# Altium schematic sheet demo_dermis_main_testboard_ibias.SchDoc
size E
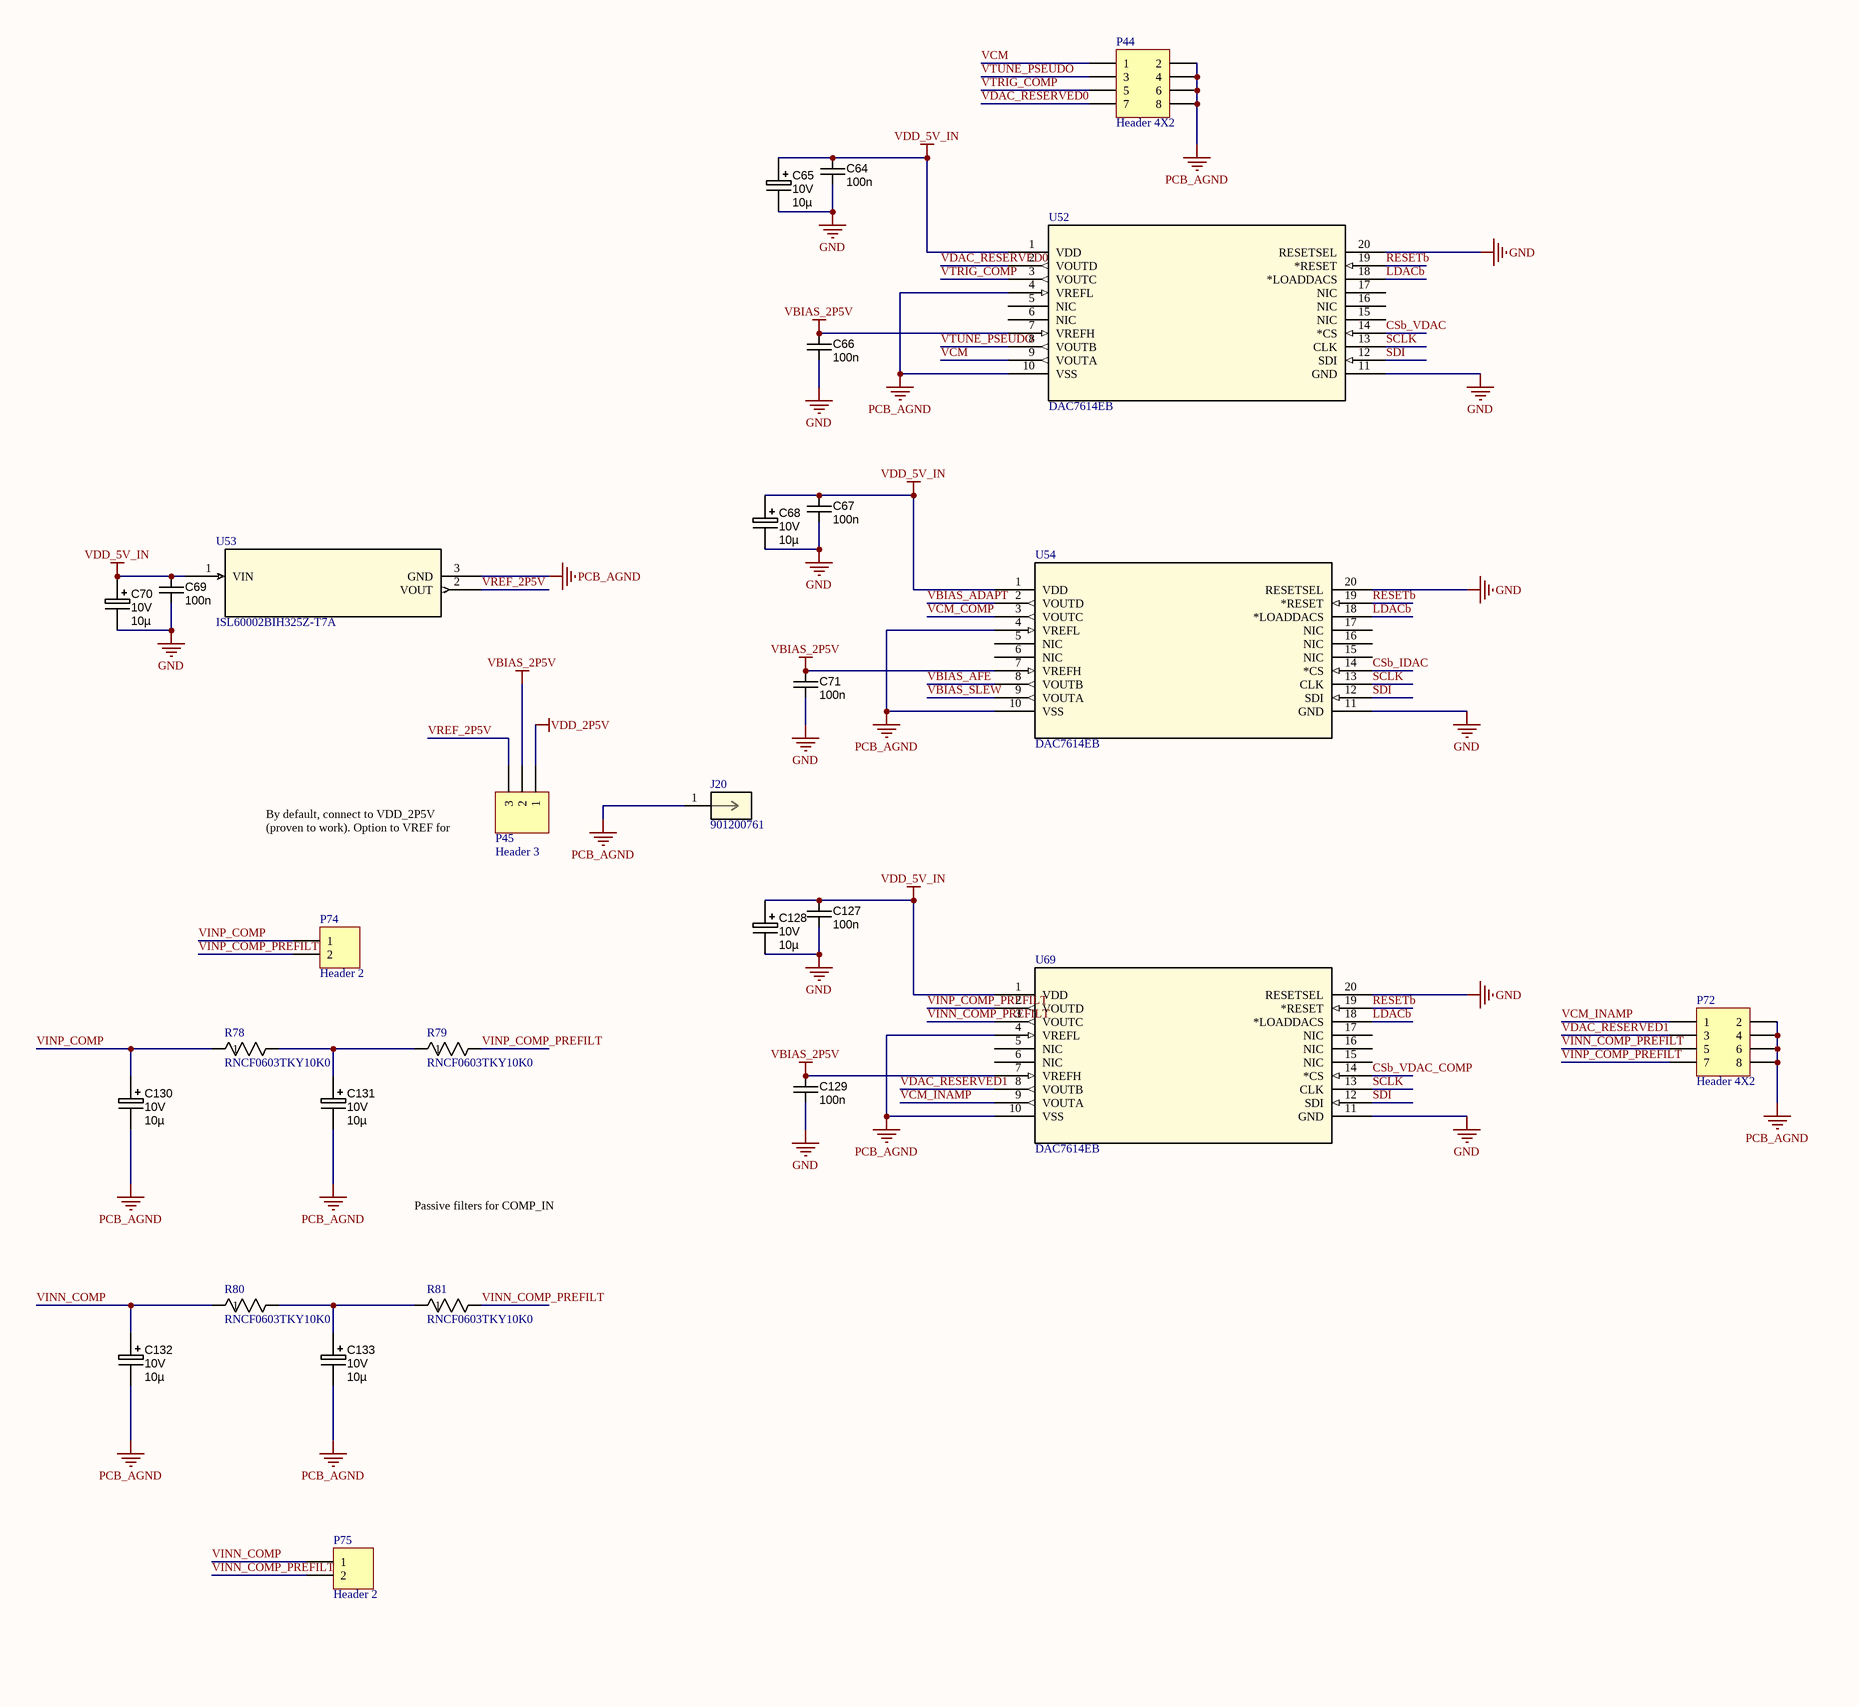
[diagram p0: demo_dermis_main_testboard_ibias.SchDoc, top]
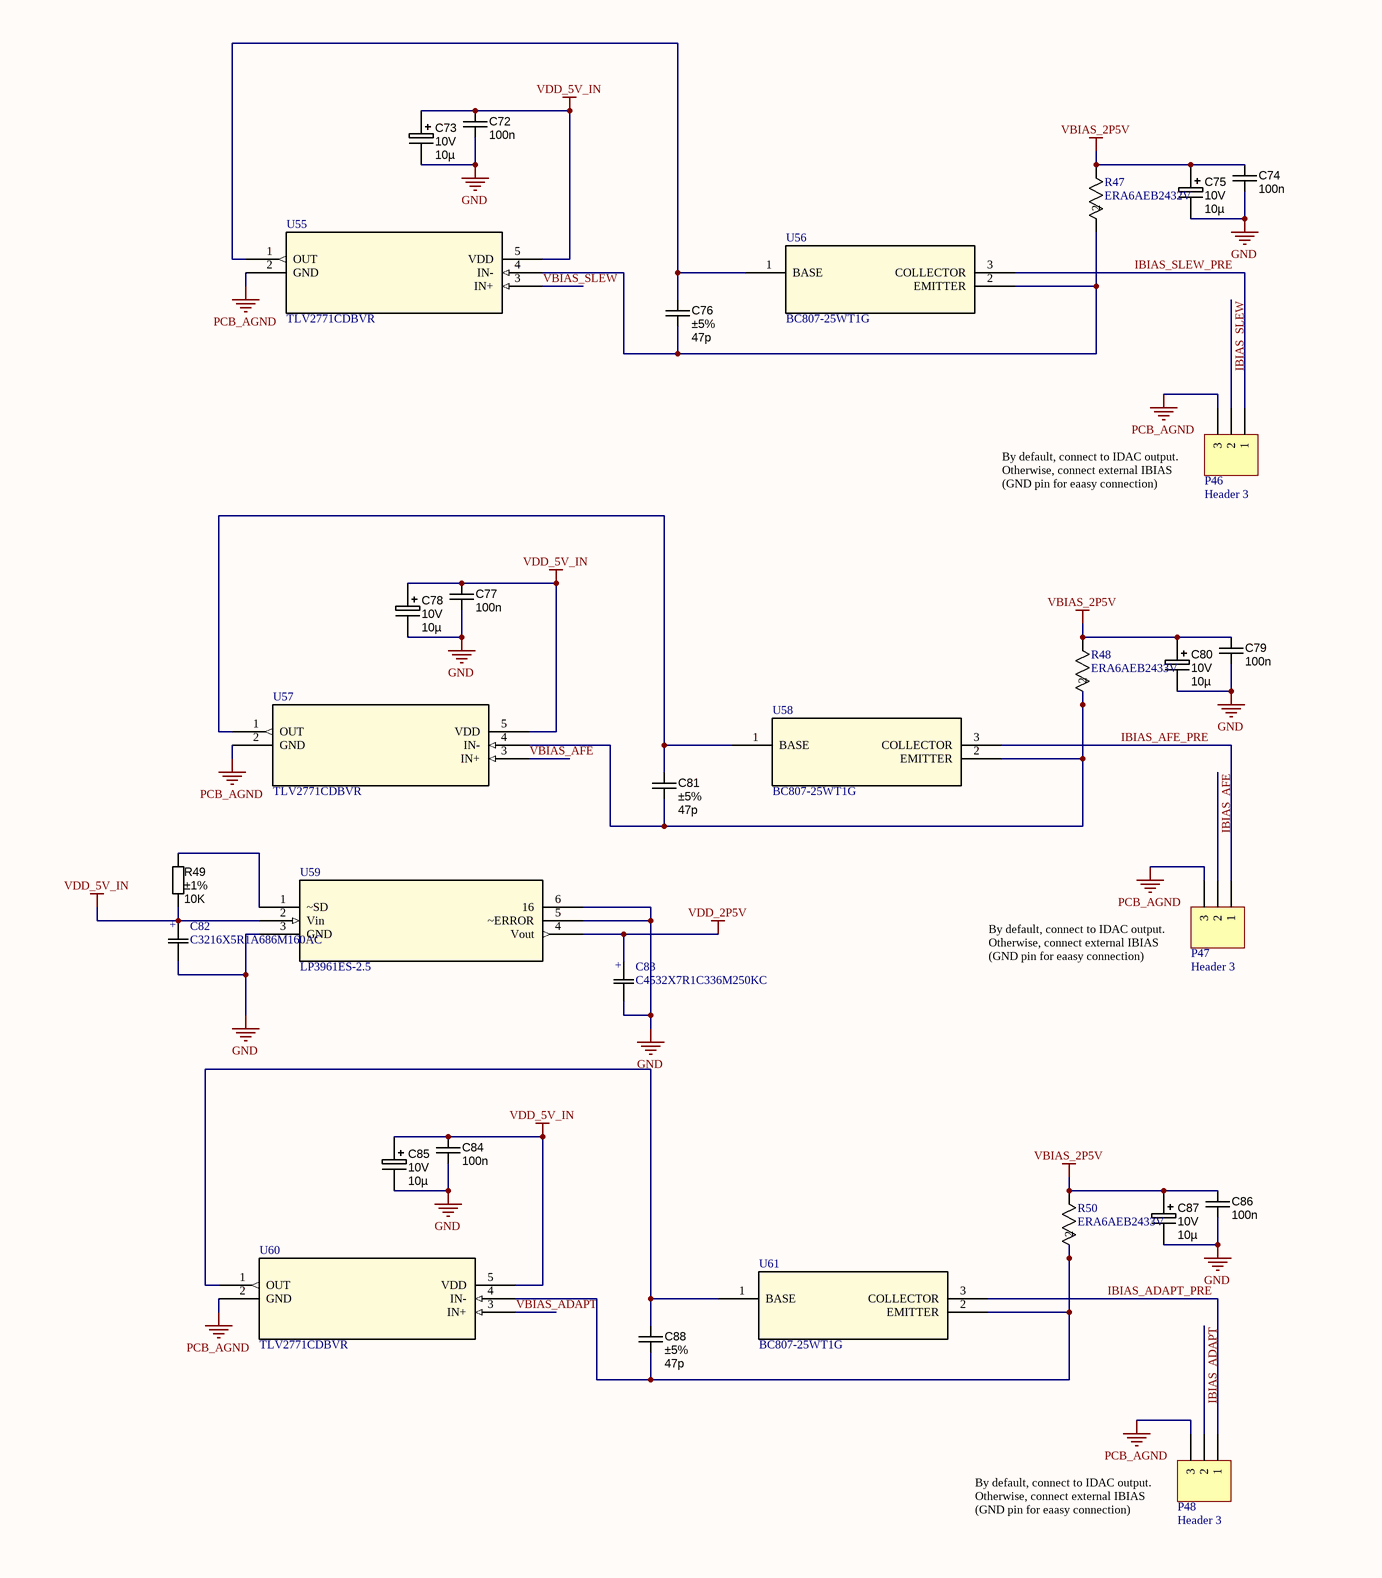
[diagram p1: demo_dermis_main_testboard_ibias.SchDoc, bottom]

## Parts
C64  value 100n  [CAPC1608N]  (hidden comment: approved sub OK)
C65  Ratings: 10V  [CAPMP2012X150USR]  (hidden comment: 10µ)
C66  value 100n  [CAPC1608N]  (hidden comment: approved sub OK)
C67  value 100n  [CAPC1608N]  (hidden comment: approved sub OK)
C68  Ratings: 10V  [CAPMP2012X150USR]  (hidden comment: 10µ)
C69  value 100n  [CAPC1608N]  (hidden comment: approved sub OK)
C70  Ratings: 10V  [CAPMP2012X150USR]  (hidden comment: 10µ)
C71  value 100n  [CAPC1608N]  (hidden comment: approved sub OK)
C72  value 100n  [CAPC1608N]  (hidden comment: approved sub OK)
C73  Ratings: 10V  [CAPMP2012X150USR]  (hidden comment: 10µ)
C74  value 100n  [CAPC1608N]  (hidden comment: approved sub OK)
C75  Ratings: 10V  [CAPMP2012X150USR]  (hidden comment: 10µ)
C76  Tolerance: ±5%  [CAPC1608N]  (hidden comment: 47p)
C77  value 100n  [CAPC1608N]  (hidden comment: approved sub OK)
C78  Ratings: 10V  [CAPMP2012X150USR]  (hidden comment: 10µ)
C79  value 100n  [CAPC1608N]  (hidden comment: approved sub OK)
C80  Ratings: 10V  [CAPMP2012X150USR]  (hidden comment: 10µ)
C81  Tolerance: ±5%  [CAPC1608N]  (hidden comment: 47p)
C82  C3216X5R1A686M160AC  [CAP_3216_TDK]
C83  C4532X7R1C336M250KC  [CAP_4532_TDK]
C84  value 100n  [CAPC1608N]  (hidden comment: approved sub OK)
C85  Ratings: 10V  [CAPMP2012X150USR]  (hidden comment: 10µ)
C86  value 100n  [CAPC1608N]  (hidden comment: approved sub OK)
C87  Ratings: 10V  [CAPMP2012X150USR]  (hidden comment: 10µ)
C88  Tolerance: ±5%  [CAPC1608N]  (hidden comment: 47p)
C127  value 100n  [CAPC1608N]  (hidden comment: approved sub OK)
C128  Ratings: 10V  [CAPMP2012X150USR]  (hidden comment: 10µ)
C129  value 100n  [CAPC1608N]  (hidden comment: approved sub OK)
C130  Ratings: 10V  [CAPMP2012X150USR]  (hidden comment: 10µ)
C131  Ratings: 10V  [CAPMP2012X150USR]  (hidden comment: 10µ)
C132  Ratings: 10V  [CAPMP2012X150USR]  (hidden comment: 10µ)
C133  Ratings: 10V  [CAPMP2012X150USR]  (hidden comment: 10µ)
J20  901200761  [CONN_90120-0761_MOL]
P44  Header 4X2  [HDR2X4]
P45  Header 3  [HDR1X3]
P46  Header 3  [HDR1X3]
P47  Header 3  [HDR1X3]
P48  Header 3  [HDR1X3]
P72  Header 4X2  [HDR2X4]
P74  Header 2  [HDR1X2]
P75  Header 2  [HDR1X2]
R47  ERA6AEB2432V  [RES_ERA6A_0805_PAN]
R48  ERA6AEB2433V  [RES_ERA6A_0805_PAN]
R49  value 10K  Tolerance: ±1%  [RESC1608N]  (hidden comment: Thick Film)
R50  ERA6AEB2433V  [RES_ERA6A_0805_PAN]
R78  RNCF0603TKY10K0  [STA_RNCF0603_STP]
R79  RNCF0603TKY10K0  [STA_RNCF0603_STP]
R80  RNCF0603TKY10K0  [STA_RNCF0603_STP]
R81  RNCF0603TKY10K0  [STA_RNCF0603_STP]
U52  DAC7614EB  [DB20]
U53  ISL60002BIH325Z-T7A  [P3_064_INR]
U54  DAC7614EB  [DB20]
U55  TLV2771CDBVR  [DBV5]
U56  BC807-25WT1G  [SOT-323-3_2P2X1P35_ONS]
U57  TLV2771CDBVR  [DBV5]
U58  BC807-25WT1G  [SOT-323-3_2P2X1P35_ONS]
U59  LP3961ES-2.5  [TS5B_TEX]
U60  TLV2771CDBVR  [DBV5]
U61  BC807-25WT1G  [SOT-323-3_2P2X1P35_ONS]
U69  DAC7614EB  [DB20]

## Nets
GND: C64.2 C65.2 C66.2 C67.2 C68.2 C69.2 C70.2 C71.2 C72.2 C73.2 C74.2 C75.2 C77.2 C78.2 C79.2 C80.2 C82.2 C83.2 C84.2 C85.2 C86.2 C87.2 C127.2 C128.2 C129.2 U52.11(GND) U52.20(RESETSEL) U54.11(GND) U54.20(RESETSEL) U59.3(GND) U59.5(~ERROR) U59.6(16) U69.11(GND) U69.20(RESETSEL)
PCB_AGND: C130.2 C131.2 C132.2 C133.2 J20.1 P44.2 P44.4 P44.6 P44.8 P46.3 P47.3 P48.3 P72.2 P72.4 P72.6 P72.8 U52.4(VREFL) U52.10(VSS) U53.3(GND) U54.4(VREFL) U54.10(VSS) U55.2(GND) U57.2(GND) U60.2(GND) U69.4(VREFL) U69.10(VSS)
VBIAS_2P5V: C66.1 C71.1 C74.1 C75.1 C79.1 C80.1 C86.1 C87.1 C129.1 P45.2 R47.1 R48.1 R50.1 U52.7(VREFH) U54.7(VREFH) U69.7(VREFH)
VDD_2P5V: C83.1 P45.1 U59.4(Vout)
VDD_5V_IN: C64.1 C65.1 C67.1 C68.1 C69.1 C70.1 C72.1 C73.1 C77.1 C78.1 C82.1 C84.1 C85.1 C127.1 C128.1 R49.2 U52.1(VDD) U53.1(VIN) U54.1(VDD) U55.5(VDD) U57.5(VDD) U59.2(Vin) U60.5(VDD) U69.1(VDD)
CSb_IDAC: U54.14(*CS)
CSb_VDAC: U52.14(*CS)
CSb_VDAC_COMP: U69.14(*CS)
IBIAS_ADAPT: P48.2
IBIAS_ADAPT_PRE: P48.1 U61.3(COLLECTOR)
IBIAS_AFE: P47.2
IBIAS_AFE_PRE: P47.1 U58.3(COLLECTOR)
IBIAS_SLEW: P46.2
IBIAS_SLEW_PRE: P46.1 U56.3(COLLECTOR)
LDACb: U52.18(*LOADDACS) U54.18(*LOADDACS) U69.18(*LOADDACS)
RESETb: U52.19(*RESET) U54.19(*RESET) U69.19(*RESET)
SCLK: U52.13(CLK) U54.13(CLK) U69.13(CLK)
SDI: U52.12(SDI) U54.12(SDI) U69.12(SDI)
VBIAS_ADAPT: U54.2(VOUTD) U60.3(IN+)
VBIAS_AFE: U54.8(VOUTB) U57.3(IN+)
VBIAS_SLEW: U54.9(VOUTA) U55.3(IN+)
VCM: P44.1 U52.9(VOUTA)
VCM_COMP: U54.3(VOUTC)
VCM_INAMP: P72.1 U69.9(VOUTA)
VDAC_RESERVED0: P44.7 U52.2(VOUTD)
VDAC_RESERVED1: P72.3 U69.8(VOUTB)
VINN_COMP: C132.1 P75.1 R80.1
VINN_COMP_PREFILT: P72.5 P75.2 R81.2 U69.3(VOUTC)
VINP_COMP: C130.1 P74.1 R78.1
VINP_COMP_PREFILT: P72.7 P74.2 R79.2 U69.2(VOUTD)
VREF_2P5V: P45.3 U53.2(VOUT)
VTRIG_COMP: P44.5 U52.3(VOUTC)
VTUNE_PSEUDO: P44.3 U52.8(VOUTB)
NetC76_1: C76.1 R47.2 U55.4(IN-) U56.2(EMITTER)
NetC76_2: C76.2 U55.1(OUT) U56.1(BASE)
NetC81_1: C81.1 R48.2 U57.4(IN-) U58.2(EMITTER)
NetC81_2: C81.2 U57.1(OUT) U58.1(BASE)
NetC88_1: C88.1 R50.2 U60.4(IN-) U61.2(EMITTER)
NetC88_2: C88.2 U60.1(OUT) U61.1(BASE)
NetC131_1: C131.1 R78.2 R79.1
NetC133_1: C133.1 R80.2 R81.1
NetR49_1: R49.1 U59.1(~SD)

Not connected (* = marked no-connect by the designer): U52 5(NIC) 6(NIC) 15(NIC) 16(NIC) 17(NIC); U54 5(NIC) 6(NIC) 15(NIC) 16(NIC) 17(NIC); U69 5(NIC) 6(NIC) 15(NIC) 16(NIC) 17(NIC)

## Notes on the sheet
- By default, connect to VDD_2P5V (proven to work). Option to VREF for better accuracy
- Passive filters for COMP_IN
- (near P46) By default, connect to IDAC output. Otherwise, connect external IBIAS (GND pin for eaasy connection)
- (near P47) By default, connect to IDAC output. Otherwise, connect external IBIAS (GND pin for eaasy connection)
- (near P48) By default, connect to IDAC output. Otherwise, connect external IBIAS (GND pin for eaasy connection)
- (in symbol C3216X5R1A686M160AC) +
- (in symbol C4532X7R1C336M250KC) +

## Library data of the parts
C64 C66 C67 C69 C71 C72 C74 C77 C79 C84 C86 C127 C129 = CAPC_100n_0603: Capacitor SMD Cer 100nF 10% 50V X7R 0603; Manufacturer 1: AVX Corporation; Manufacturer Part Number 1: 06035C104KAT2A; Ratings: 50V; X7R; Material: ceramic; Manufacturer 2: TDK Corporation; Manufacturer Part Number 2: C1608X7R1H104K; Package / Case: 0603 (1608 Metric); Tolerance: ±10%; Supplier 1: Digi-Key; Supplier Part Number 1: 478-5052-1-ND; ComponentLink1URL: http://www.avx.com/docs/Catalogs/cx7r.pdf; ComponentLink1Description: http://www.avx.com/docs/Catalogs/cx7r.pdf; Supplier 2: Digi-Key; Supplier Part Number 2: 445-1314-1-ND; ComponentLink2URL: http://product.tdk.com/capacitor/mlcc/en/documents/mlcc_commercial_general_en.pdf; ComponentLink2Description: http://product.tdk.com/capacitor/mlcc/en/documents/mlcc_commercial_general_en.pdf
C65 C68 C70 C73 C75 C78 C80 C85 C87 C128 C130-C133 = CAPT_10u_0805_10V: Capacitor SMD Tantalum 10uF 20% 10V 0805; Manufacturer 1: AVX Corporation; Manufacturer Part Number 1: TAJP106M010RNJ; Package / Case: 0805 (2012 metric); Tolerance: ±20%; Material: Tantalum; Supplier 1: Digi-Key; Supplier Part Number 1: 478-3281-1-ND; Value: 10µ
C76 C81 C88 = CAPC_47p_0603: Capacitor SMD Cer 47pF 0603; Ratings: 50V; NP0; Operating Temperature: -55°C ~ 125°C; Package / Case: 0603 (1608 Metric); Size / Dimension: 0.063" L x 0.031" W (1.60mm x 0.80mm); Thickness (Max): 0.037" (0.95mm); ComponentLink1URL: http://www.avx.com/docs/Catalogs/ccog.pdf; ComponentLink1Description: http://www.avx.com/docs/Catalogs/ccog.pdf; ComponentLink2URL: http://www.tdk.com/pdf/tight_tol_B11.pdf; ComponentLink2Description: http://www.tdk.com/pdf/tight_tol_B11.pdf; ComponentLink3URL: http://www.kemet.com/datasheets&C0603C221F5GACTU; ComponentLink3Description: http://www.kemet.com/datasheets&C0603C221F5GACTU; Value: 47p
C82 = C3216X5R1A686M160AC: No Description Available; Mfr_Name: TDK; Type: DEV; Copyright: Copyright (C) 2022 Ultra Librarian. All rights reserved.; Manufacturer_Part_Number: C3216X5R1A686M160AC; RefDes: RefDes
C83 = C4532X7R1C336M250KC: No Description Available; Mfr_Name: TDK; Type: DEV; Copyright: Copyright (C) 2022 Ultra Librarian. All rights reserved.; Manufacturer_Part_Number: C4532X7R1C336M250KC; RefDes: RefDes
J20 = 901200761: No Description Available; Mfr_Name: Molex Connector Corporation; Copyright: Copyright (C) 2022 Ultra Librarian. All rights reserved.; Manufacturer_Part_Number: 901200761; RefDes: RefDes; Type: DEV
P44 P72 = Header 4X2: Header, 4-Pin, Dual row; LatestRevisionDate: 17-Jul-2002; LatestRevisionNote: Re-released for DXP Platform.; Publisher: Altium Limited
P45-P48 = Header 3: Header, 3-Pin; LatestRevisionDate: 17-Jul-2002; LatestRevisionNote: Re-released for DXP Platform.; Publisher: Altium Limited
P74 P75 = Header 2: Header, 2-Pin; LatestRevisionDate: 17-Jul-2002; LatestRevisionNote: Re-released for DXP Platform.; Publisher: Altium Limited
R47 = ERA6AEB2432V: No Description Available; Mfr_Name: Panasonic
R48 R50 = ERA6AEB2433V: No Description Available; Mfr_Name: Panasonic
R49 = RES_10K_0603_1%: Resistor SMD chip 10k Ohm 0.1W 1% 0603; Manufacturer 1: Yageo; Manufacturer Part Number 1: RC0603FR-0710KL; Ratings: 1/10W; Package / Case: 0603 (1608 Metric); Supplier 1: Digi-Key; Supplier Part Number 1: 311-10.0KHRCT-ND
R78-R81 = RNCF0603TKY10K0: No Description Available; Mfr_Name: Stackpole International
U52 U54 U69 = DAC7614EB: No Description Available; Mfr_Name: Texas Instruments; Copyright: Copyright (C) 2022 Ultra Librarian. All rights reserved.; Manufacturer_Part_Number: DAC7614EB; RefDes: RefDes; Type: DEV
U53 = ISL60002BIH325Z-T7A: No Description Available; Mfr_Name: Renesas / Intersil; RefDes: RefDes; Type: Type
U55 U57 U60 = TLV2771CDBVR: No Description Available; Mfr_Name: Texas Instruments; Copyright: Copyright (C) 2022 Ultra Librarian. All rights reserved.; Manufacturer_Part_Number: TLV2771CDBVR; RefDes: RefDes; Type: DEV
U56 U58 U61 = BC807-25WT1G: No Description Available; Mfr_Name: onsemi; RefDes: RefDes; Type: Type
U59 = LP3961ES-2.5: No Description Available; Mfr_Name: Texas Instruments; Copyright: Copyright (C) 2022 Ultra Librarian. All rights reserved.; Manufacturer_Part_Number: LP3961ES-2.5; RefDes: RefDes; Type: DEV